# Altium project sensor shoot2.PrjPcb
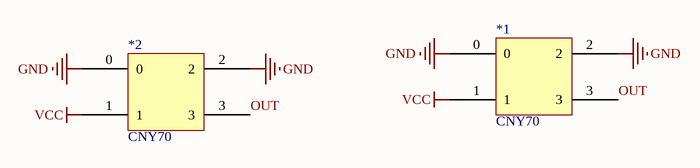
[diagram p0: Sensor shoot2.SchDoc]
1 sheet, 2 parts. Net scope: global (net labels, ports and power ports of the same name join across sheets).
Board file: Sensor shoot2.PcbDoc

## Sheet Sensor shoot2.SchDoc
size A

### Parts
*1  CNY70  [CNY70]
*2  CNY70  [CNY70]

### Nets
GND: *1.0 *1.2 *2.0 *2.2
VCC: *1.1 *2.1
OUT: *1.3 *2.3